# EAGLE design demeter_v21 (EAGLE 6.2)
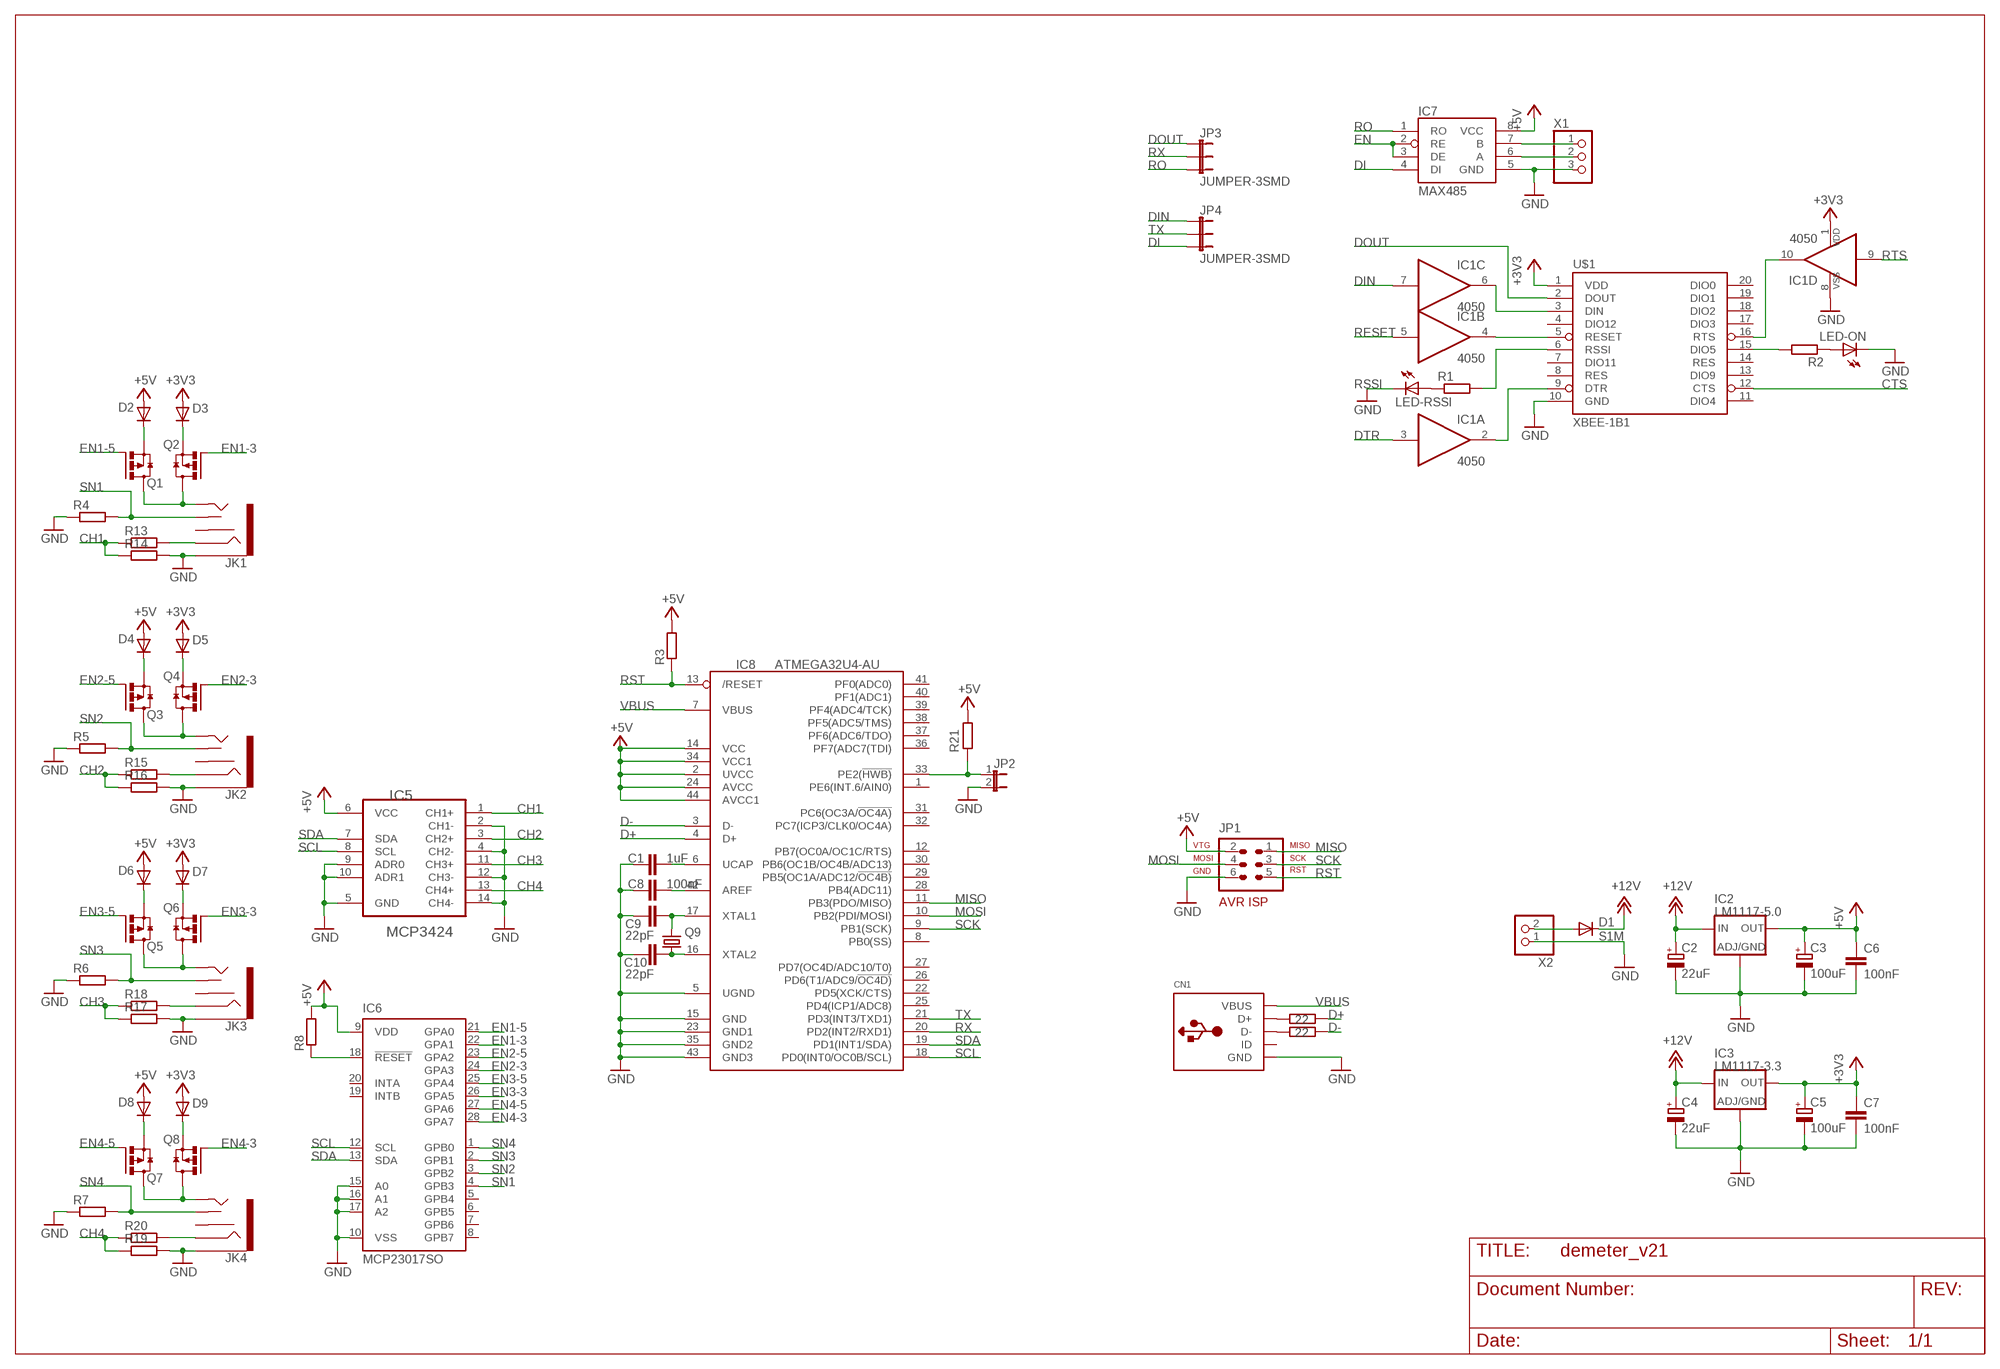
[diagram p0: schematic, sheet 1]

## Parts
C1  1uF  C-EUC0805K  [C0805K]
C2  22uF  CPOL-EUPD  [PANASONIC_D]
C3  100uF  CPOL-EUPD  [PANASONIC_D]
C4  22uF  CPOL-EUPD  [PANASONIC_D]
C5  100uF  CPOL-EUPD  [PANASONIC_D]
C6  100nF  C-EUC0805K  [C0805K]
C7  100nF  C-EUC0805K  [C0805K]
C8  100nF  C-EUC0805K  [C0805K]
C9  22pF  C-EUC0805K  [C0805K]
C10  22pF  C-EUC0805K  [C0805K]
CN1  USBMINIB  [USB-MINIB]
D1  S1M  [DO-214AC]
D2  MBR0520  [SOD123]
D3  MBR0520  [SOD123]
D4  MBR0520  [SOD123]
D5  MBR0520  [SOD123]
D6  MBR0520  [SOD123]
D7  MBR0520  [SOD123]
D8  MBR0520  [SOD123]
D9  MBR0520  [SOD123]
IC1  4050  4050D  [SO16]
IC2  LM1117-5.0  LM1117DT  [DPACK]
IC3  LM1117-3.3  LM1117DT  [DPACK]
IC5  MCP3424  [SO14]
IC6  MCP23017SO  [SO28W]
IC7  MAX485  [SO08]
IC8  ATMEGA32U4-AU  [TQFP44]
JK1  AUDIO-JACK2PTH  [AUDIO-JACK]
JK2  AUDIO-JACK2PTH  [AUDIO-JACK]
JK3  AUDIO-JACK2PTH  [AUDIO-JACK]
JK4  AUDIO-JACK2PTH  [AUDIO-JACK]
JP1  AVR-ISP-6  [AVR-ISP-6]
JP2  JUMPER-2SMD-NO  [SJ_2S-NO]
JP3  JUMPER-3SMD  [SJ_3]
JP4  JUMPER-3SMD  [SJ_3]
LED-ON  LED3MM  [LED3MM]
LED-RSSI  LED3MM  [LED3MM]
Q1  IRLML6402  [SOT23]
Q2  IRLML6402  [SOT23]
Q3  IRLML6402  [SOT23]
Q4  IRLML6402  [SOT23]
Q5  IRLML6402  [SOT23]
Q6  IRLML6402  [SOT23]
Q7  IRLML6402  [SOT23]
Q8  IRLML6402  [SOT23]
Q9  CRYSTALHC49UP  [HC49UP]
R1  R-EU_R0805  [R0805]
R2  R-EU_R0805  [R0805]
R3  R-EU_R0805  [R0805]
R4  R-EU_R0805  [R0805]
R5  R-EU_R0805  [R0805]
R6  R-EU_R0805  [R0805]
R7  R-EU_R0805  [R0805]
R8  R-EU_R0805  [R0805]
R9  22  R-EU_R0805  [R0805]
R10  22  R-EU_R0805  [R0805]
R13  R-EU_R0805  [R0805]
R14  R-EU_R0805  [R0805]
R15  R-EU_R0805  [R0805]
R16  R-EU_R0805  [R0805]
R17  R-EU_R0805  [R0805]
R18  R-EU_R0805  [R0805]
R19  R-EU_R0805  [R0805]
R20  R-EU_R0805  [R0805]
R21  R-EU_R0805  [R0805]
U$1  XBEE-1B1  [XBEE-1]
X1  W237-103  [W237-103]
X2  W237-102  [W237-102]

## Nets
+3V3: C5.+ C7.1 D3.A D5.A D7.A D9.A IC1.1(P:VDD) IC3.4(OUT) U$1.1(VDD)
+5V: C3.+ C6.1 D2.A D4.A D6.A D8.A IC2.4(OUT) IC5.6(VCC) IC6.9(VDD) IC7.8(VCC) IC8.2(UVCC) IC8.14(VCC) IC8.24(AVCC) IC8.34(VCC1) IC8.44(AVCC1) JP1.2(VTG) R3.2 R8.2 R21.1
+12V: C2.+ C4.+ D1.C IC2.3(IN) IC3.3(IN)
CH1: IC5.1(CH1+) R13.1 R14.1
CH2: IC5.3(CH2+) R15.1 R16.1
CH3: IC5.11(CH3+) R17.1 R18.1
CH4: IC5.13(CH4+) R19.1 R20.1
CTS: U$1.12(CTS)
D+: IC8.4(D+) R9.1
D-: IC8.3(D-) R10.1
DI: IC7.4(DI) JP4.3
DIN: IC1.7(C:I) JP4.1
DOUT: JP3.1 U$1.2(DOUT)
DTR: IC1.3(A:I)
EN: IC7.2(RE) IC7.3(DE)
EN1-3: IC6.22(GPA1) Q2.1(G)
EN1-5: IC6.21(GPA0) Q1.1(G)
EN2-3: IC6.24(GPA3) Q4.1(G)
EN2-5: IC6.23(GPA2) Q3.1(G)
EN3-3: IC6.26(GPA5) Q6.1(G)
EN3-5: IC6.25(GPA4) Q5.1(G)
EN4-3: IC6.28(GPA7) Q8.1(G)
EN4-5: IC6.27(GPA6) Q7.1(G)
GND: C1.2 C2.- C3.- C4.- C5.- C6.2 C7.2 C8.2 C9.2 C10.2 CN1.GND IC1.8(P:VSS) IC2.1(ADJ) IC3.1(ADJ) IC5.2(CH1-) IC5.4(CH2-) IC5.5(GND) IC5.9(ADR0) IC5.10(ADR1) IC5.12(CH3-) IC5.14(CH4-) IC6.10(VSS) IC6.15(A0) IC6.16(A1) IC6.17(A2) IC7.5(GND) IC8.5(UGND) IC8.15(GND) IC8.23(GND1) IC8.35(GND2) IC8.43(GND3) JK1.SLEEVE JK2.SLEEVE JK3.SLEEVE JK4.SLEEVE JP1.6(GND) JP2.2 LED-ON.K(C) LED-RSSI.K(C) R4.1 R5.1 R6.1 R7.1 R14.2 R16.2 R17.2 R19.2 U$1.10(GND) X1.3 X2.1
MISO: IC8.11(PB3(PDO/MISO)) JP1.1(MISO)
MOSI: IC8.10(PB2(PDI/MOSI)) JP1.4(MOSI)
N$1: D1.A X2.2
N$2: IC7.7(B) X1.1
N$3: IC1.6(C:O) U$1.3(DIN)
N$4: IC1.4(B:O) U$1.5(RESET)
N$5: IC7.6(A) X1.2
N$6: LED-RSSI.A R1.1
N$7: IC1.2(A:O) U$1.9(DTR)
N$8: IC1.10(D:O) U$1.16(RTS)
N$9: LED-ON.A R2.1
N$10: R2.2 U$1.15(DIO5)
N$11: IC6.18(!RESET) R8.1
N$12: JK1.TIP Q1.3(D) Q2.3(D)
N$13: D2.C Q1.2(S)
N$14: D3.C Q2.2(S)
N$15: JK2.TIP Q3.3(D) Q4.3(D)
N$16: D4.C Q3.2(S)
N$17: D5.C Q4.2(S)
N$18: JK3.TIP Q5.3(D) Q6.3(D)
N$19: D6.C Q5.2(S)
N$20: D7.C Q6.2(S)
N$21: JK4.TIP Q7.3(D) Q8.3(D)
N$22: D8.C Q7.2(S)
N$23: D9.C Q8.2(S)
N$24: C1.1 IC8.6(UCAP)
N$25: C8.1 IC8.42(AREF)
N$26: C9.1 IC8.17(XTAL1) Q9.2
N$27: C10.1 IC8.16(XTAL2) Q9.1
N$28: CN1.D+ R9.2
N$29: CN1.D- R10.2
N$30: JK1.RING R13.2
N$32: JK2.RING R15.2
N$34: JK3.RING R18.2
N$35: JK4.RING R20.2
N$36: IC8.33(PE2(!HWB)) JP2.1 R21.2
RESET: IC1.5(B:I)
RO: IC7.1(RO) JP3.3
RSSI: R1.2 U$1.6(RSSI)
RST: IC8.13(/RESET) JP1.5(RST) R3.1
RTS: IC1.9(D:I)
RX: IC8.20(PD2(INT2/RXD1)) JP3.2
SCK: IC8.9(PB1(SCK)) JP1.3(SCK)
SCL: IC5.8(SCL) IC6.12(SCL) IC8.18(PD0(INT0/OC0B/SCL))
SDA: IC5.7(SDA) IC6.13(SDA) IC8.19(PD1(INT1/SDA))
SN1: IC6.4(GPB3) JK1.TSH R4.2
SN2: IC6.3(GPB2) JK2.TSH R5.2
SN3: IC6.2(GPB1) JK3.TSH R6.2
SN4: IC6.1(GPB0) JK4.TSH R7.2
TX: IC8.21(PD3(INT3/TXD1)) JP4.2
VBUS: CN1.VBUS IC8.7(VBUS)
Unconnected: CN1.ID IC1.11(E:I) IC1.12(E:O) IC1.14(F:I) IC1.15(F:O) IC6.5(GPB4) IC6.6(GPB5) IC6.7(GPB6) IC6.8(GPB7) IC6.19(INTB) IC6.20(INTA) IC8.1(PE6(INT.6/AIN0)) IC8.8(PB0(SS)) IC8.12(PB7(OC0A/OC1C/RTS)) IC8.22(PD5(XCK/CTS)) IC8.25(PD4(ICP1/ADC8)) IC8.26(PD6(T1/ADC9/!OC4D)) IC8.27(PD7(OC4D/ADC10/T0)) IC8.28(PB4(ADC11)) IC8.29(PB5(OC1A/ADC12/!OC4B)) IC8.30(PB6(OC1B/OC4B/ADC13)) IC8.31(PC6(OC3A/!OC4A)) IC8.32(PC7(ICP3/CLK0/OC4A)) IC8.36(PF7(ADC7(TDI)) IC8.37(PF6(ADC6/TDO)) IC8.38(PF5(ADC5/TMS)) IC8.39(PF4(ADC4/TCK)) IC8.40(PF1(ADC1)) IC8.41(PF0(ADC0)) JK1.RSH JK2.RSH JK3.RSH JK4.RSH U$1.4(DIO12) U$1.7(DIO11) U$1.8(RES) U$1.11(DIO4) U$1.13(DIO9) U$1.14(RES) U$1.17(DIO3) U$1.18(DIO2) U$1.19(DIO1) U$1.20(DIO0)

## Library data of the parts
C1 C6-C10 = mark_2:C-EU: CAPACITOR, European symbol
C2-C5 = mark_2:CPOL-EU: POLARIZED CAPACITOR, European symbol
CN1 = mark_2:USB: USB Connectors USBMINIB - Surface Mount Female Mini-B USB Connector 4UConnector: 06564 By microbuilder.eu Thru-hole RA Female Mini-B USB Connector 4UConnector: 18732 By ladyada.net
D1 = mark_2:S1M
D2-D9 = mark_2:MBR0520: SCHOTTKY BARRIER RECTIFIER Source: http://onsemi.com .. MBR0520LT1-D.pdf
IC1 = mark_2:4050: Hex non-inverting BUFFER
IC2 IC3 = mark_2:LM1117: Low drop fixed and adjustable positive voltage regulators 1 A Source: http://www.st.com/stonline/products/literature/ds/7194/ld1117axx.pdf
IC5 = mark_2:MCP3424: Analog-to-Digital Converter; MPN: MCP3424-E/SL; OC_FARNELL: 1630424; OC_NEWARK: 54M4871; PACKAGE: SOIC-14; SUPPLIER: Microchip
IC6 = mark_2:MCP23017: http://ww1.microchip.com/downloads/en/DeviceDoc/21952a.pdf Source: http://ww1.microchip.com/downloads/en/DeviceDoc/21952a.pdf; MF: MICROCHIP; MPN: MCP23017-E/SO; OC_FARNELL: 1332087; OC_NEWARK: 31K2958
IC7 = mark_2:MAX485
IC8 = mark_2:ATMEGA32U4: http://www.ladyada.net/library/eagle
JK1-JK4 = mark_2:AUDIO-JACK2
JP1 = mark_2:AVR-ISP-6: AVR ISP-6 Serial Programming Header
JP2 = mark_2:JUMPER-2: Jumper Basic 0.1" spaced jumper. Use with breakaway headers.
JP3 JP4 = mark_2:JUMPER-3
LED-ON LED-RSSI = mark_1:LED
Q1-Q8 = mark_2:IRLML6402: Single P-Channe MOSFET
Q9 = mark_2:CRYSTAL: CRYSTAL
R1-R10 R13-R21 = mark_2:R-EU_: RESISTOR, European symbol
U$1 = mark_2:XBEE-1
X1 = mark_2:W237-103: WAGO SCREW CLAMP
X2 = mark_2:W237-102: WAGO SCREW CLAMP

## Board
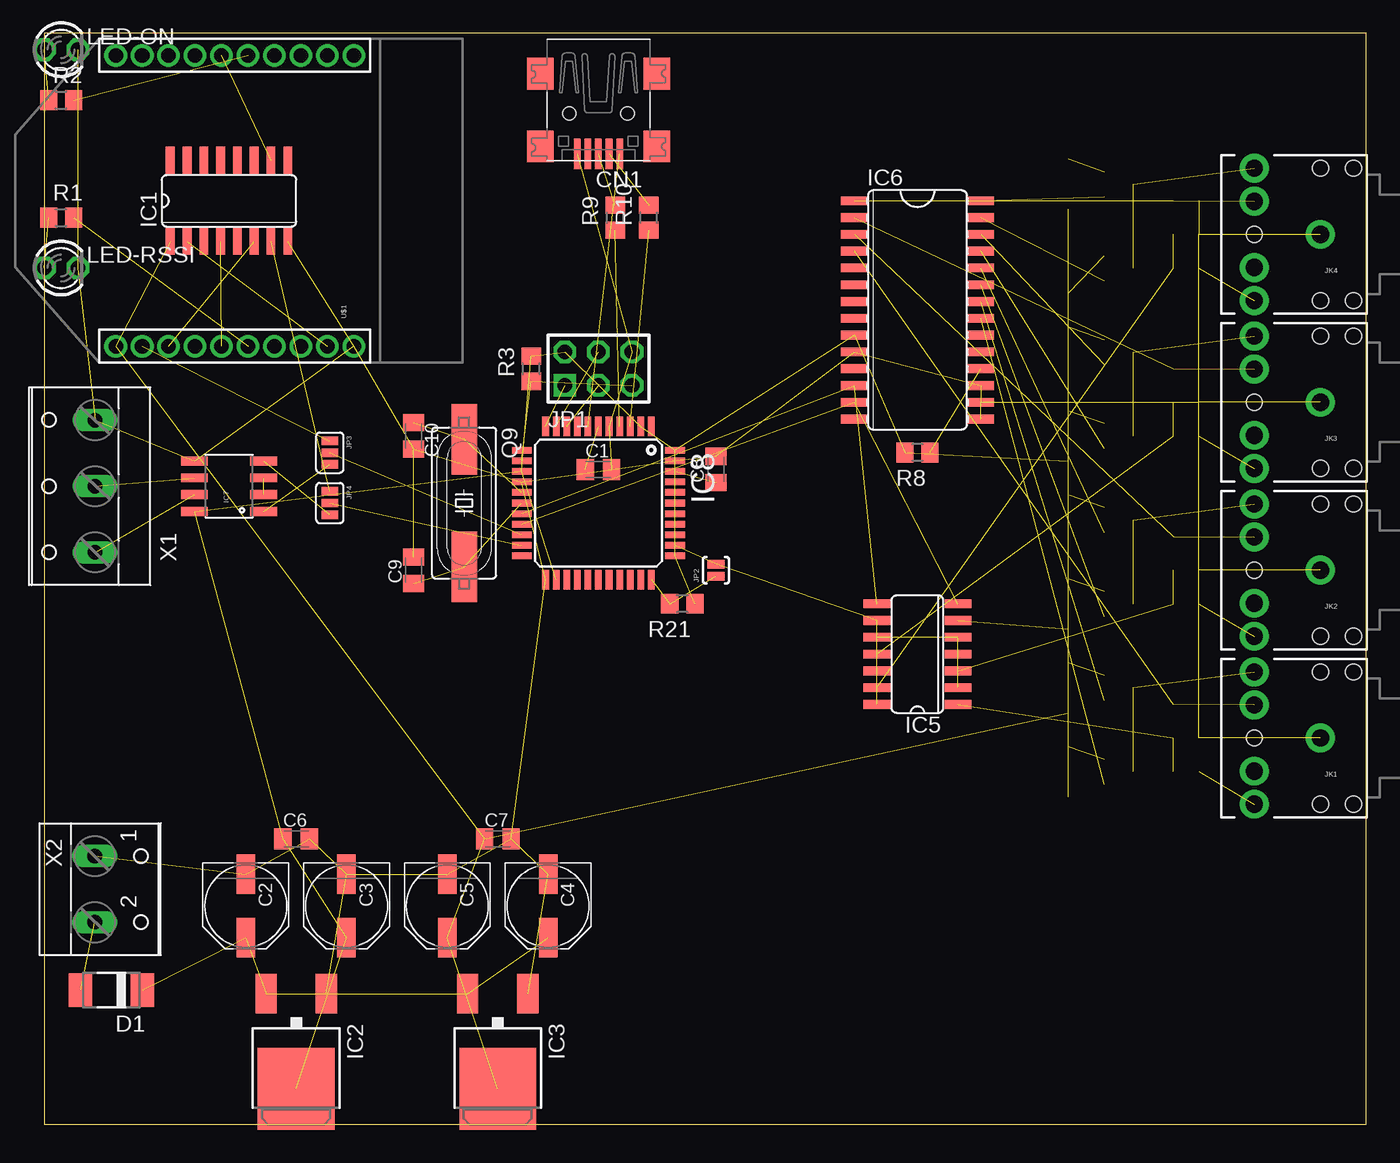
[diagram p1: board, top side]
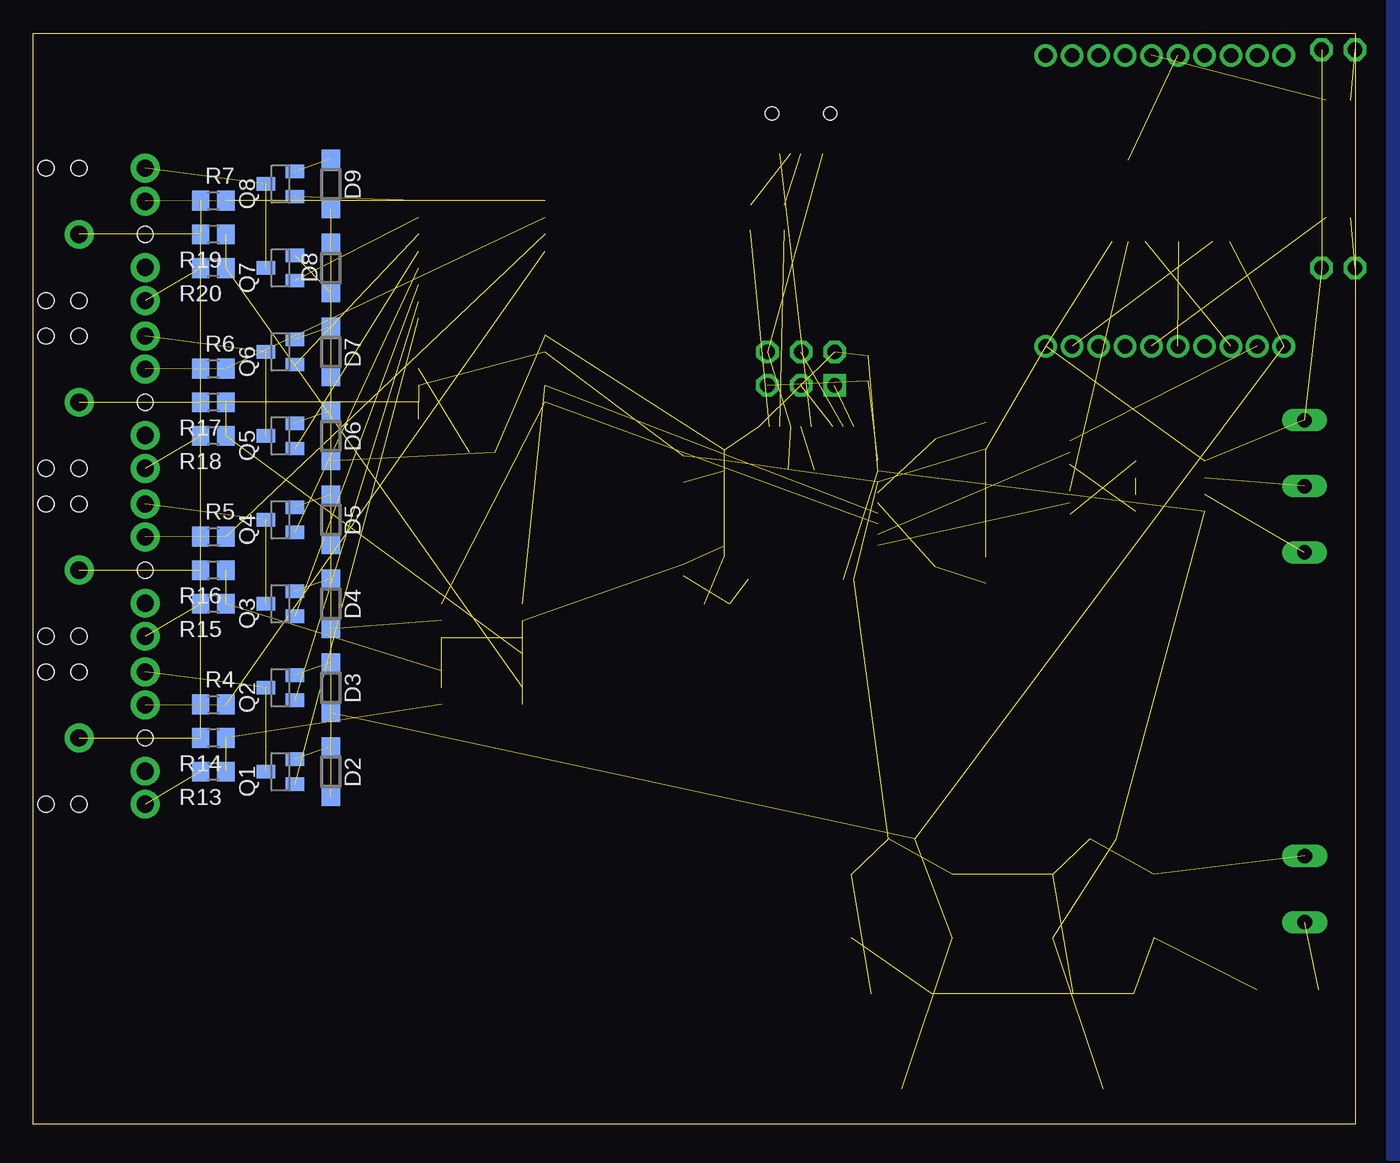
[diagram p2: board, bottom side, seen from below]

Size 100 x 82.54 mm. Coordinates in mm from the lower left corner, seen from the top.
Outline: 0,0 100,0 100,82.54 0,82.54 0,0
Copper layers (1*16): Top 0.035mm / dielectric 1.5mm / Bottom 0.035mm
Design rules: minimum track width 12mil, minimum drill 1.1mm, track to track 8mil, track to pad 8mil, pad to pad 8mil, via to via 8mil, smd to smd 8mil, copper to edge 10mil, drill to drill 8mil, minimum pad ring 12mil, minimum via ring 10mil, stop-mask expansion 4mil, vias tented up to drill 25mil, thermal gap 10mil

### Footprints (pad centres in the part's own frame; a part is rotated, then mirrored left to right if it is on the bottom)
C0805K = smd 1.3 x 1.6: 1 -1,0; 2 1,0
PANASONIC_D = smd 3 x 1.4: + 2.4,0; - -2.4,0
USB-MINIB = smd 0.5 x 2.308: D+ 0,4.064; D- -0.8,4.064; GND 1.6,4.064; ID 0.8,4.064; VBUS -1.6,4.064 | smd 2 x 2.4: GND1 -4.4,-2; GND2 -4.4,3.5; GND3 4.4,3.5; GND4 4.4,-2 | hole 1: -2.2,1; 2.2,1
DO-214AC = smd 1.778 x 2.54: A 2.342,0; C -2.342,0
SOD123 = smd 1.4 x 1.4: A 1.9,0; C -1.9,0
SO16 = smd 0.66 x 2.032: 1 -4.445,-3.073; 2 -3.175,-3.073; 3 -1.905,-3.073; 4 -0.635,-3.073; 5 0.635,-3.073; 6 1.905,-3.073; 7 3.175,-3.073; 8 4.445,-3.073; 9 4.445,3.073; 10 3.175,3.073; 11 1.905,3.073; 12 0.635,3.073; 13 -0.635,3.073; 14 -1.905,3.073; 15 -3.175,3.073; 16 -4.445,3.073
DPACK = smd 1.6 x 3: 1 -2.28,-4.8; 3 2.28,-4.8 | smd 5.8 x 6.2: 4 0,2.38
SO14 = smd 2.032 x 0.66: 1 -3.073,3.81; 2 -3.073,2.54; 3 -3.073,1.27; 4 -3.073,0; 5 -3.073,-1.27; 6 -3.073,-2.54; 7 -3.073,-3.81; 8 3.073,-3.81; 9 3.073,-2.54; 10 3.073,-1.27; 11 3.073,0; 12 3.073,1.27; 13 3.073,2.54; 14 3.073,3.81
SO28W = smd 0.66 x 2.032: 1 -7.62,-4.78; 2 -6.35,-4.78; 3 -5.08,-4.78; 4 -3.81,-4.78; 5 -2.54,-4.78; 6 -1.27,-4.78; 7 0,-4.78; 8 1.27,-4.78; 9 2.54,-4.78; 10 3.81,-4.78; 11 5.08,-4.78; 12 6.35,-4.78; 13 7.62,-4.78; 14 8.89,-4.78; 15 8.89,4.78; 16 7.62,4.78; 17 6.35,4.78; 18 5.08,4.78; 19 3.81,4.78; 20 2.54,4.78; 21 1.27,4.78; 22 0,4.78; 23 -1.27,4.78; 24 -2.54,4.78; 25 -3.81,4.78; 26 -5.08,4.78; 27 -6.35,4.78; 28 -7.62,4.78
SO08 = smd 0.66 x 2.032: 1 -1.905,-2.616; 2 -0.635,-2.616; 3 0.635,-2.616; 4 1.905,-2.616; 5 1.905,2.616; 6 0.635,2.616; 7 -0.635,2.616; 8 -1.905,2.616
TQFP44 = smd 1.5 x 0.5: 1 -5.8,4; 2 -5.8,3.2; 3 -5.8,2.4; 4 -5.8,1.6; 5 -5.8,0.8; 6 -5.8,0; 7 -5.8,-0.8; 8 -5.8,-1.6; 9 -5.8,-2.4; 10 -5.8,-3.2; 11 -5.8,-4; 23 5.8,-4; 24 5.8,-3.2; 25 5.8,-2.4; 26 5.8,-1.6; 27 5.8,-0.8; 28 5.8,0; 29 5.8,0.8; 30 5.8,1.6; 31 5.8,2.4; 32 5.8,3.2; 33 5.8,4 | smd 0.5 x 1.5: 12 -4,-5.8; 13 -3.2,-5.8; 14 -2.4,-5.8; 15 -1.6,-5.8; 16 -0.8,-5.8; 17 0,-5.8; 18 0.8,-5.8; 19 1.6,-5.8; 20 2.4,-5.8; 21 3.2,-5.8; 22 4,-5.8; 34 4,5.8; 35 3.2,5.8; 36 2.4,5.8; 37 1.6,5.8; 38 0.8,5.8; 39 0,5.8; 40 -0.8,5.8; 41 -1.6,5.8; 42 -2.4,5.8; 43 -3.2,5.8; 44 -4,5.8
AUDIO-JACK = drill 1.3 pad 2.184: RING 5,5; RSH 5,2.5; SLEEVE 0,0; TIP 5,-5; TSH 5,-2.5 | hole 1.2: 0,5; -2.5,5; -2.5,-5; 0,-5; 5,0
AVR-ISP-6 = drill 1.1 square: 1 -2.54,-1.27 | drill 1.1 octagon: 2 -2.54,1.27; 3 0,-1.27; 4 0,1.27; 5 2.54,-1.27; 6 2.54,1.27
SJ_2S-NO = smd 0.635 x 1.27: 1 -0.45,0; 2 0.45,0
SJ_3 = smd 0.635 x 1.27: 1 -0.889,0; 2 0,0; 3 0.889,0
LED3MM = drill 1.1 octagon: A -1.27,0; K 1.27,0
SOT23 = smd 1 x 1.4: 1 -0.95,-1.1; 2 0.95,-1.1; 3 0,1.1
HC49UP = smd 5.334 x 1.93: 1 -4.826,0; 2 4.826,0
R0805 = smd 1.3 x 1.5: 1 -0.95,0; 2 0.95,0
XBEE-1 = drill 1.1: 1 -11,20; 2 -11,18; 3 -11,16; 4 -11,14; 5 -11,12; 6 -11,10; 7 -11,8; 8 -11,6; 9 -11,4; 10 -11,2; 11 11,2; 12 11,4; 13 11,6; 14 11,8; 15 11,10; 16 11,12; 17 11,14; 18 11,16; 19 11,18; 20 11,20
W237-103 = drill 1.1 long: 1 -5,-1.29; 2 0,-1.29; 3 5,-1.29
W237-102 = drill 1.1 long: 1 -2.5,-1.27; 2 2.5,-1.27

### Placement (x,y rotation side)
C1  41.91,49.53 0 top
C2  15.24,16.51 270 top
C3  22.86,16.51 270 top
C4  38.1,16.51 270 top
C5  30.48,16.51 270 top
C6  19.05,21.59 0 top
C7  34.29,21.59 0 top
C8  50.8,49.53 90 top
C9  27.94,41.91 90 top
C10  27.94,52.07 270 top
CN1  41.91,77.47 180 top
D1  5.08,10.16 180 top
D2  77.47,26.67 270 bottom
D3  77.47,33.02 270 bottom
D4  77.47,39.37 270 bottom
D5  77.47,45.72 270 bottom
D6  77.47,52.07 270 bottom
D7  77.47,58.42 270 bottom
D8  77.47,64.77 90 bottom
D9  77.47,71.12 270 bottom
IC1  13.97,69.85 0 top
IC2  19.05,5.08 180 top
IC3  34.29,5.08 180 top
IC5  66.04,35.56 180 top
IC6  66.04,62.23 270 top
IC7  13.97,48.26 90 top
IC8  41.91,46.99 270 top
JK1  96.52,29.21 180 top
JK2  96.52,41.91 180 top
JK3  96.52,54.61 180 top
JK4  96.52,67.31 180 top
JP1  41.91,57.15 0 top
JP2  50.8,41.91 90 top
JP3  21.59,50.8 270 top
JP4  21.59,46.99 270 top
LED-ON  1.27,81.28 0 top
LED-RSSI  1.27,64.77 0 top
Q1  81.28,26.67 90 bottom
Q2  81.28,33.02 90 bottom
Q3  81.28,39.37 90 bottom
Q4  81.28,45.72 90 bottom
Q5  81.28,52.07 90 bottom
Q6  81.28,58.42 90 bottom
Q7  81.28,64.77 90 bottom
Q8  81.28,71.12 90 bottom
Q9  31.75,46.99 270 top
R1  1.27,68.58 0 top
R2  1.27,77.47 0 top
R3  36.83,57.15 90 top
R4  86.36,31.75 0 bottom
R5  86.36,44.45 0 bottom
R6  86.36,57.15 0 bottom
R7  86.36,69.85 0 bottom
R8  66.04,50.8 180 top
R9  43.18,68.58 90 top
R10  45.72,68.58 90 top
R13  86.36,26.67 180 bottom
R14  86.36,29.21 180 bottom
R15  86.36,39.37 180 bottom
R16  86.36,41.91 180 bottom
R17  86.36,54.61 180 bottom
R18  86.36,52.07 180 bottom
R19  86.36,67.31 180 bottom
R20  86.36,64.77 180 bottom
R21  48.26,39.37 180 top
U$1  25.4,69.85 90 top
X1  2.54,48.26 90 top
X2  5.08,17.78 270 top

### Tracks (layer width: path | path; a pad name or v marks a point on that pad's centre or on a via)
+3V3  (8 unrouted)
+5V  (18 unrouted)
+12V  (4 unrouted)
CH1  (2 unrouted)
CH2  (2 unrouted)
CH3  (2 unrouted)
CH4  (2 unrouted)
D+  (1 unrouted)
D-  (1 unrouted)
DI  (1 unrouted)
DIN  (1 unrouted)
DOUT  (1 unrouted)
EN  (1 unrouted)
EN1-3  (1 unrouted)
EN1-5  (1 unrouted)
EN2-3  (1 unrouted)
EN2-5  (1 unrouted)
EN3-3  (1 unrouted)
EN3-5  (1 unrouted)
EN4-3  (1 unrouted)
EN4-5  (1 unrouted)
GND  (49 unrouted)
  pour Bottom (isolate 0.813): -2.54,85.09 -21.59,85.09 -21.59,-2.54 -2.54,-2.54
MISO  (1 unrouted)
MOSI  (1 unrouted)
N$1  (1 unrouted)
N$2  (1 unrouted)
N$3  (1 unrouted)
N$4  (1 unrouted)
N$5  (1 unrouted)
N$6  (1 unrouted)
N$7  (1 unrouted)
N$8  (1 unrouted)
N$9  (1 unrouted)
N$10  (1 unrouted)
N$11  (1 unrouted)
N$12  (2 unrouted)
N$13  (1 unrouted)
N$14  (1 unrouted)
N$15  (2 unrouted)
N$16  (1 unrouted)
N$17  (1 unrouted)
N$18  (2 unrouted)
N$19  (1 unrouted)
N$20  (1 unrouted)
N$21  (2 unrouted)
N$22  (1 unrouted)
N$23  (1 unrouted)
N$24  (1 unrouted)
N$25  (1 unrouted)
N$26  (2 unrouted)
N$27  (2 unrouted)
N$28  (1 unrouted)
N$29  (1 unrouted)
N$30  (1 unrouted)
N$32  (1 unrouted)
N$34  (1 unrouted)
N$35  (1 unrouted)
N$36  (2 unrouted)
RO  (1 unrouted)
RSSI  (1 unrouted)
RST  (2 unrouted)
RX  (1 unrouted)
SCK  (1 unrouted)
SCL  (2 unrouted)
SDA  (2 unrouted)
SN1  (2 unrouted)
SN2  (2 unrouted)
SN3  (2 unrouted)
SN4  (2 unrouted)
TX  (1 unrouted)
VBUS  (1 unrouted)